# Altium project ESP32-watch.PrjPcb
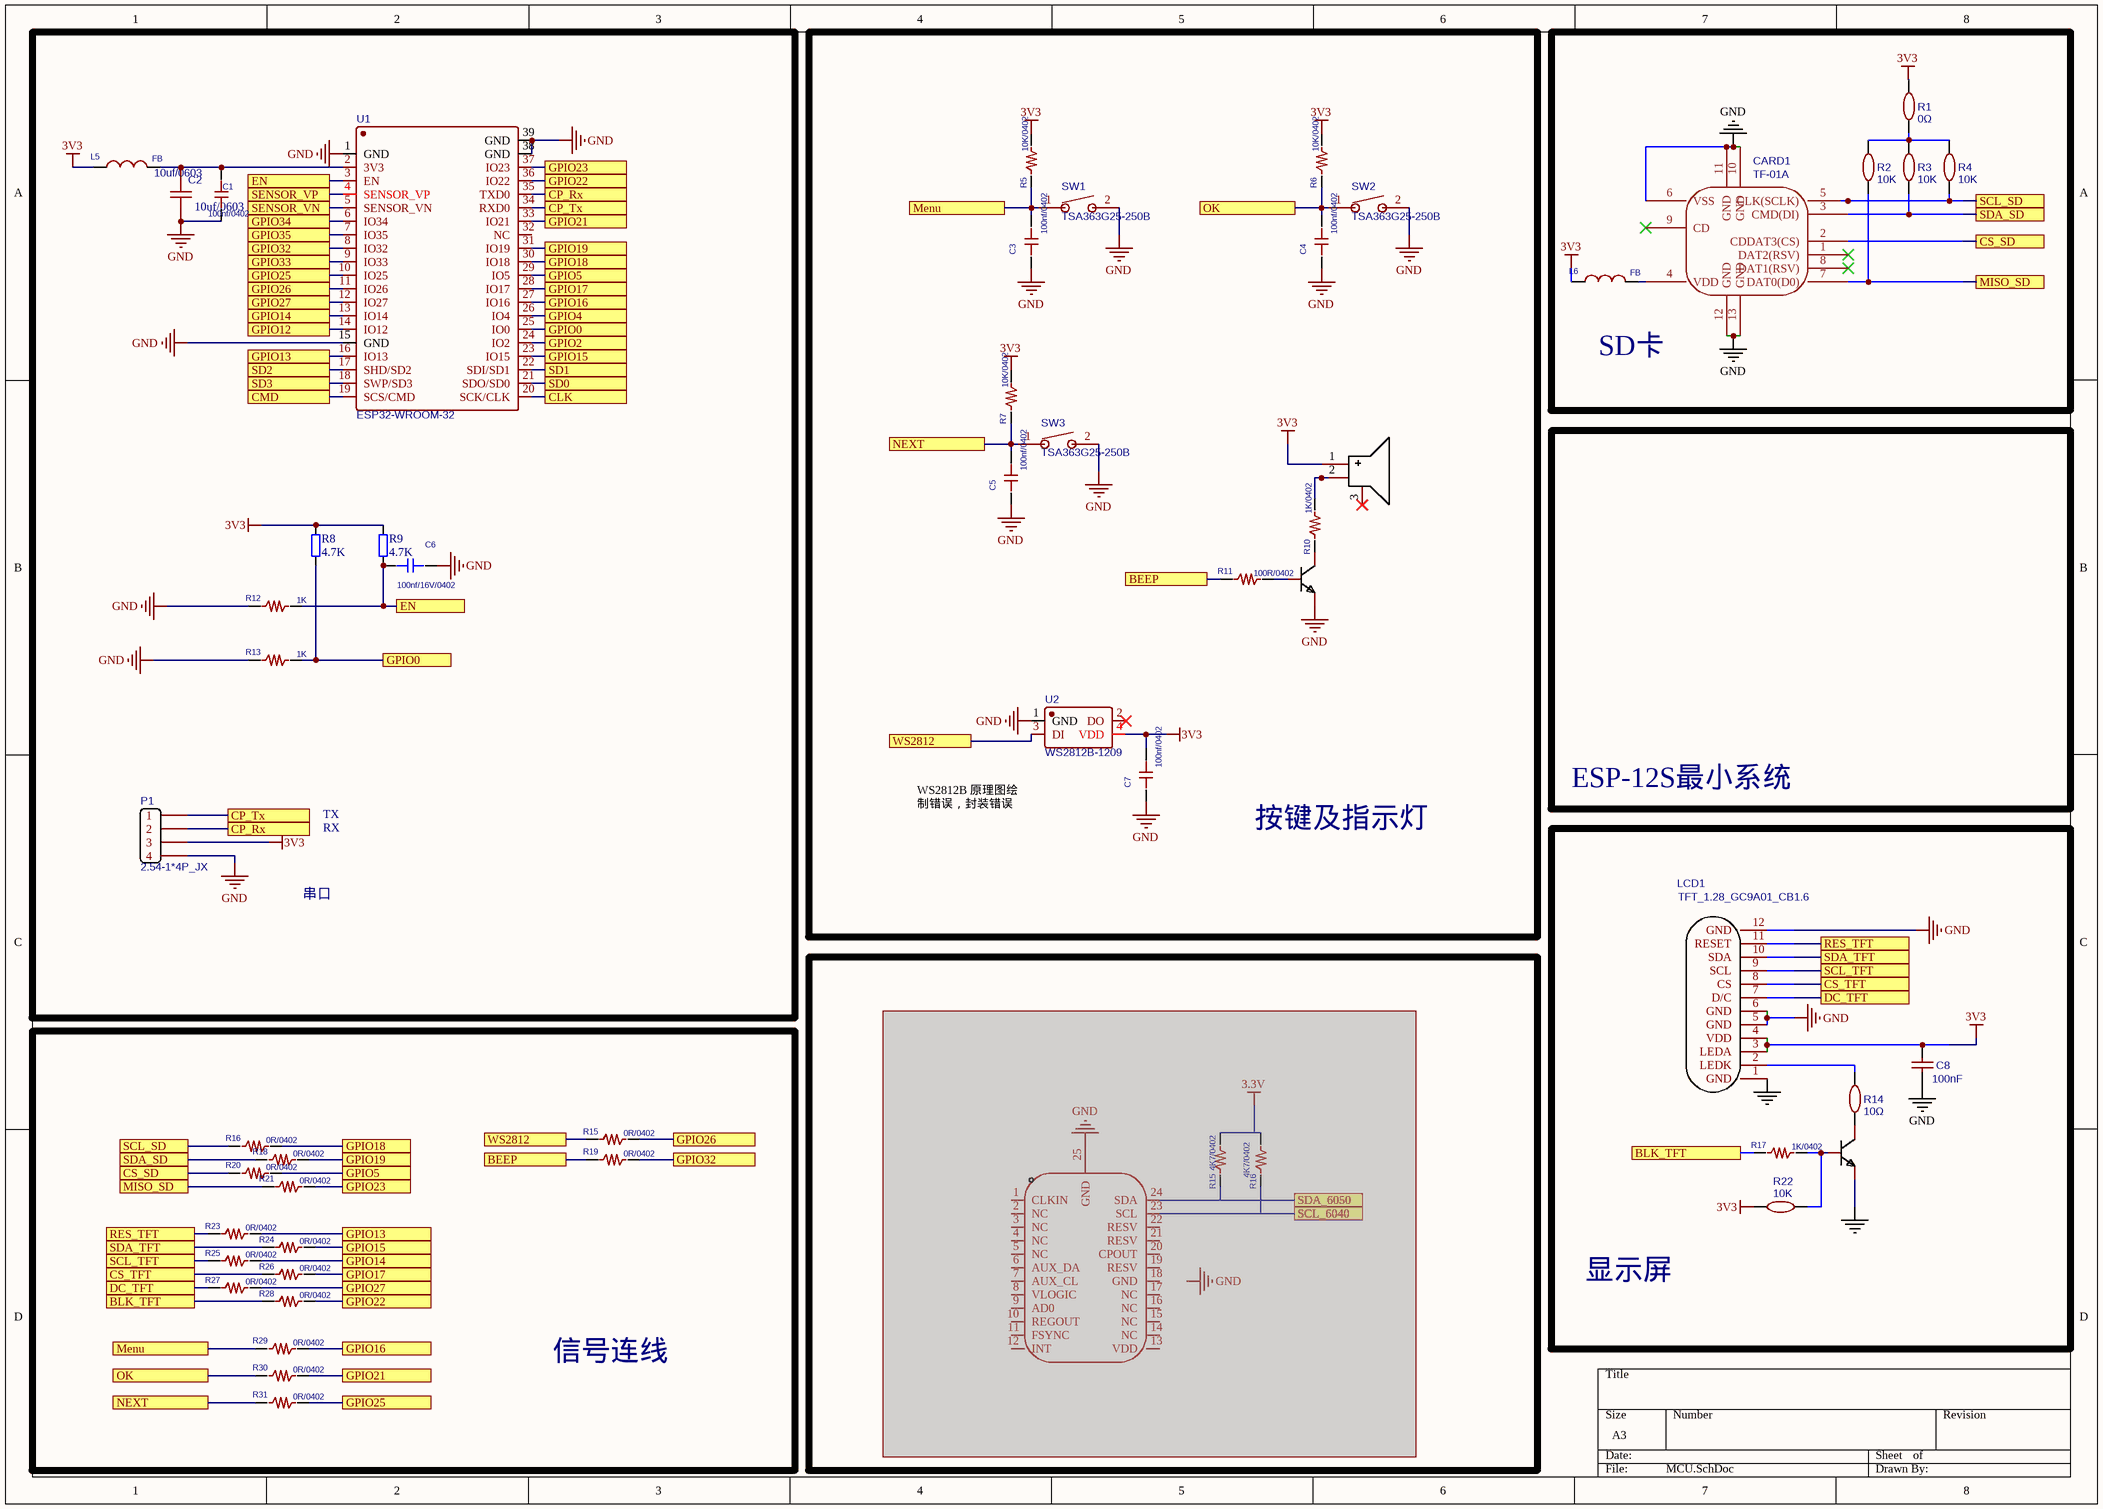
[diagram p0: MCU.SchDoc]
2 sheets, 94 parts. Net scope: global (net labels, ports and power ports of the same name join across sheets).
Board file: watch_esp32.PcbDoc
Sheets:
  MCU.SchDoc
  POWER.SchDoc

## Sheet MCU.SchDoc
size A3

### Parts
(Parts that share a designator on the sheet are numbered #1, #2 ... from top to bottom, then left to right.)
BEEP？1  KLJ-5020  [BUZ-SMD_4P-L5.0-W5.0-P3.80]  (value not drawn)
C1  value 100nf/0402  [C0402]  (hidden comment: 100nf)
C2  10uf/0603  [C0603]
C3  value 100nf/0402  [C0402]  (hidden comment: 100nf)
C4  value 100nf/0402  [C0402]  (hidden comment: 100nf)
C5  value 100nf/0402  [C0402]  (hidden comment: C0402)
C6  value 100nf/16V/0402  [C0402]  (hidden comment: 100nf)
C7  value 100nf/0402  [C0402]  (hidden comment: 100nf)
C8  100nF  [C0402]
CARD1  TF-01A  [TF-SMD_TF-01A]
L5  value FB  [L0603]  (hidden comment: FB0603)
L6  value FB  [R0402]  (hidden comment: FB0402)
LCD1  TFT_1.28_GC9A01_CB1.6  [TFT_1.28_GC9A01_CB0.8_Short]
P1  2.54-1*4P_JX  [CON2X2_SMD_2.54]
Q1  S8050  [SOT-23-3_L2.9-W1.6-P1.90]  (value not drawn)
Q2  S8050  [SOT-23-3_L2.9-W1.6-P1.90]  (value not drawn)
R1  0Ω  [R0603]
R2  10K  [R0402]
R3  10K  [R0402]
R4  10K  [R0402]
R5  value 10K/0402  [R0402]  (hidden comment: 10K)
R6  value 10K/0402  [R0402]  (hidden comment: 10K)
R7  value 10K/0402  [R0402]  (hidden comment: 10K)
R8  4.7K  [R0402]
R9  4.7K  [R0402]
R10  value 1K/0402  [R0402]  (hidden comment: 10K)
R11  value 100R/0402  [R0402]  (hidden comment: 100R)
R12  value 1K  [R0603]  (hidden comment: EN)
R13  value 1K  [R0603]  (hidden comment: GPIO0)
R14  10Ω  [R0402]
R15#1  value 4K7/0402  [R0402]  (hidden comment: R0603)  (masked out: inside a compile mask, not in the netlist)
R15#2  value 0R/0402  [R0402]  (hidden comment: 0R)
R16#1  value 4K7/0402  [R0402]  (hidden comment: R0603)  (masked out: inside a compile mask, not in the netlist)
R16#2  value 0R/0402  [R0402]  (hidden comment: 0R)
R17  value 1K/0402  [R0402]  (hidden comment: 1K)
R18  value 0R/0402  [R0402]  (hidden comment: 0R)
R19  value 0R/0402  [R0402]  (hidden comment: 0R)
R20  value 0R/0402  [R0402]  (hidden comment: 0R)
R21  value 0R/0402  [R0402]  (hidden comment: 0R)
R22  10K  [R0402]
R23  value 0R/0402  [R0402]  (hidden comment: 0R)
R24  value 0R/0402  [R0402]  (hidden comment: 0R)
R25  value 0R/0402  [R0402]  (hidden comment: 0R)
R26  value 0R/0402  [R0402]  (hidden comment: 0R)
R27  value 0R/0402  [R0402]  (hidden comment: 0R)
R28  value 0R/0402  [R0402]  (hidden comment: 0R)
R29  value 0R/0402  [R0402]  (hidden comment: 0R)
R30  value 0R/0402  [R0402]  (hidden comment: 0R)
R31  value 0R/0402  [R0402]  (hidden comment: 0R)
SW1  TSA363G25-250B  [KEY-SMD4_4.5X2.5]
SW2  TSA363G25-250B  [KEY-SMD4_4.5X2.5]
SW3  TSA363G25-250B  [KEY-SMD4_4.5X2.5]
U1  ESP32-WROOM-32  [ESP32-WROOM]
U2#1  WS2812B-1209  [WS2812B]
U2#2  MPU-6050  [QFN-24_L4.0-W4.0-P0.50]  (value not drawn)  (masked out: inside a compile mask, not in the netlist)

### Blocks framed on the sheet
串口: C1 C2 C6 L5 P1 R8 R9 R12 R13 U1
按键及指示灯: BEEP？1 C3-C5 C7 Q1 R5-R7 R10 R11 SW1-SW3 U2#1
SD卡: CARD1 L6 R1-R4
显示屏: C8 LCD1 Q2 R14 R17 R22
信号连线: R15#2 R16#2 R18-R21 R23-R31

### Ports
BEEP, BLK_TFT, CLK, CMD, CP_Rx, CP_Tx, CS_SD, CS_TFT, DC_TFT, EN, GPIO0, GPIO2, GPIO4, GPIO5, GPIO12, GPIO13, GPIO14, GPIO15, GPIO16, GPIO17, GPIO18, GPIO19, GPIO21, GPIO22, GPIO23, GPIO25, GPIO26, GPIO27, GPIO32, GPIO33, GPIO34, GPIO35, Menu, MISO_SD, NEXT, OK, RES_TFT, SCL_6040, SCL_SD, SCL_TFT, SD0, SD1, SD2, SD3, SDA_6050, SDA_SD, SDA_TFT, SENSOR_VN, SENSOR_VP, WS2812

### Nets
3V3: BEEP？1.1(+) C7.2 C8.1 L5.1 L6.1 LCD1.3(LEDA) LCD1.4(VDD) P1.3 R1.1 R5.2 R6.2 R7.2 R8.2 R9.2 R22.1 U2#1.4(VDD)
GND: C1.1 C2.1 C3.1 C4.1 C5.1 C6.1 C7.1 C8.2 CARD1.6(VSS) CARD1.10(GND) CARD1.11(GND) CARD1.12(GND) CARD1.13(GND) LCD1.1(GND) LCD1.5(GND) LCD1.6(GND) LCD1.12(GND) P1.4 Q1.2(E) Q2.2(E) R12.1 R13.1 SW1.2 SW2.2 SW3.2 U1.1(GND) U1.15(GND) U1.38(GND) U1.39(GND) U2#1.1(GND)
NetBEEP？1_2: BEEP？1.2(-) R10.2
NetC1_2: C1.2 C2.2 L5.2 U1.2(3V3)
NetC3_2: C3.2 R5.1 R29.1 SW1.1 ; port Menu
NetC4_2: C4.2 R6.1 R30.1 SW2.1 ; port OK
NetC5_2: C5.2 R7.1 R31.1 SW3.1 ; port NEXT
NetC6_2: C6.2 R9.1 R12.2 U1.3(EN) ; port EN
NetCARD1_2: CARD1.2(CDDAT3(CS)) R20.1 ; port CS_SD
NetCARD1_3: CARD1.3(CMD(DI)) R3.2 R18.1 ; port SDA_SD
NetCARD1_4: CARD1.4(VDD) L6.2
NetCARD1_5: CARD1.5(CLK(SCLK)) R4.2 R16#2.1 ; port SCL_SD
NetCARD1_7: CARD1.7(DAT0(D0)) R2.2 R21.1 ; port MISO_SD
NetLCD1_2: LCD1.2(LEDK) R14.1
NetLCD1_7: LCD1.7(D/C) R27.1 ; port DC_TFT
NetLCD1_8: LCD1.8(CS) R26.1 ; port CS_TFT
NetLCD1_9: LCD1.9(SCL) R25.1 ; port SCL_TFT
NetLCD1_10: LCD1.10(SDA) R24.1 ; port SDA_TFT
NetLCD1_11: LCD1.11(RESET) R23.1 ; port RES_TFT
NetP1_1: P1.1 U1.34(RXD0) ; port CP_Tx
NetP1_2: P1.2 U1.35(TXD0) ; port CP_Rx
NetQ1_1: Q1.1(B) R11.2
NetQ1_3: Q1.3(C) R10.1
NetQ2_1: Q2.1(B) R17.2 R22.2
NetQ2_3: Q2.3(C) R14.2
NetR1_2: R1.2 R2.1 R3.1 R4.1
NetR8_1: R8.1 R13.2 U1.25(IO0) ; port GPIO0
NetR11_1: R11.1 R19.1 ; port BEEP
NetR15#2_1: R15#2.1 U2#1.3(DI) ; port WS2812
NetR15#2_2: R15#2.2 U1.11(IO26) ; port GPIO26
NetR16#2_2: R16#2.2 U1.30(IO18) ; port GPIO18
NetR17_1: R17.1 R28.1 ; port BLK_TFT
NetR18_2: R18.2 U1.31(IO19) ; port GPIO19
NetR19_2: R19.2 U1.8(IO32) ; port GPIO32
NetR20_2: R20.2 U1.29(IO5) ; port GPIO5
NetR21_2: R21.2 U1.37(IO23) ; port GPIO23
NetR23_2: R23.2 U1.16(IO13) ; port GPIO13
NetR24_2: R24.2 U1.23(IO15) ; port GPIO15
NetR25_2: R25.2 U1.13(IO14) ; port GPIO14
NetR26_2: R26.2 U1.28(IO17) ; port GPIO17
NetR27_2: R27.2 U1.12(IO27) ; port GPIO27
NetR28_2: R28.2 U1.36(IO22) ; port GPIO22
NetR29_2: R29.2 U1.27(IO16) ; port GPIO16
NetR30_2: R30.2 U1.33(IO21) ; port GPIO21
NetR31_2: R31.2 U1.10(IO25) ; port GPIO25
NetU1_4: U1.4(SENSOR_VP) ; port SENSOR_VP
NetU1_5: U1.5(SENSOR_VN) ; port SENSOR_VN
NetU1_6: U1.6(IO34) ; port GPIO34
NetU1_7: U1.7(IO35) ; port GPIO35
NetU1_9: U1.9(IO33) ; port GPIO33
NetU1_14: U1.14(IO12) ; port GPIO12
NetU1_17: U1.17(SHD/SD2) ; port SD2
NetU1_18: U1.18(SWP/SD3) ; port SD3
NetU1_19: U1.19(SCS/CMD) ; port CMD
NetU1_20: U1.20(SCK/CLK) ; port CLK
NetU1_21: U1.21(SDO/SD0) ; port SD0
NetU1_22: U1.22(SDI/SD1) ; port SD1
NetU1_24: U1.24(IO2) ; port GPIO2
NetU1_26: U1.26(IO4) ; port GPIO4

Not connected (* = marked no-connect by the designer): BEEP？1 3(NC)*; CARD1 1(DAT2(RSV))* 8(DAT1(RSV))* 9(CD)*; U1 32(NC); U2#1 2(DO)*

### Notes on the sheet
- RX
- TX
- (near U2#1) WS2812B 原理图绘制错误，封装错误
- ESP-12S最小系统

### Library data of the parts
BEEP？1 = BEEP_3P_5020: Manufacturer: KELIKING(凯丽金); Add into BOM: yes; Name: KLJ-5020; Symbol: KLJ-5020; Device: KLJ-5020; LCSC Part Name: 贴片蜂鸣器; Supplier Part: C556937; Manufacturer Part: KLJ-5020; Supplier Footprint: SMD; JLCPCB Part Class: Extended Part; Datasheet: https://atta.szlcsc.com/upload/public/pdf/source/20200519/C556937_434224E60D77FB2EA05BB02010B3CD4E.pdf; Supplier: LCSC; Convert to PCB: yes
C1 C3-C7 = C0402: PCB DECAL: CAP_0603_FIRE
C2 = C0603: BOM_Manufacturer: Samsung Electro-Mechanics; BOM_Manufacturer Part: 10uF; nameAlias: Value; Contributor: LCSC; BOM_Supplier: LCSC; BOM_Supplier Part: C15415; spicePre: C; spiceSymbolName: 10UF
C8 = 100nF: BOM_Manufacturer: YAGEO; BOM_Manufacturer Part: CC0402KRX5R9BB104; nameAlias: Capacitance; BOM_Supplier: LCSC; BOM_Supplier Part: C105882; BOM_JLCPCB Part Class: Extended Part; spicePre: C; spiceSymbolName: CC0402KRX5R9BB104
CARD1 = TF-01A: BOM_Manufacturer: HRO; BOM_Supplier: LCSC; BOM_Manufacturer Part: TF-01A; BOM_Supplier Part: C91145; BOM_JLCPCB Part Class: Extended Part; spicePre: C; spiceSymbolName: TF-01A
L5 = FB0603: 0603; Manufacturer #1 PN: BEAD; PCB DECAL: L0603
L6 = FB0402: 0402; Manufacturer #1 PN: BEAD; PCB DECAL: L0603
LCD1 = TFT_1.28_GC9A01_CB1.6: Contributor: 启凡科创; spicePre: L; spiceSymbolName: TFT_1.28_GC9A01_CB1.6
P1 = CON1X4_2.54: BOM_Supplier Part: C115245; BOM_Supplier: LCSC; spicePre: P; spiceSymbolName: 2.54-1*4P_JX
Q1 Q2 = NPN: Manufacturer: PUOLOP(迪浦); Symbol: S8050_C2894711; Add into BOM: yes; Name: S8050; Device: S8050; LCSC Part Name: S8050; Supplier Part: C2894711; Manufacturer Part: S8050; Supplier Footprint: SOT-23; JLCPCB Part Class: Extended Part; Datasheet: https://atta.szlcsc.com/upload/public/pdf/source/20210914/8A9A4EB0A2D7D299FDA7647183468EB4.pdf; Supplier: LCSC; Convert to PCB: yes
R1 = 0Ω: BOM_Manufacturer: UniOhm; BOM_Manufacturer Part: 0603WAJ0000T5E; nameAlias: Resistance; Resistance (Ohms): 0; BOM_Supplier: LCSC; BOM_Supplier Part: C15402; BOM_JLCPCB Part Class: Extended Part; spicePre: R; spiceSymbolName: 0603WAJ0000T5E
R2-R4 R22 = 10K: BOM_Manufacturer: UniOhm; BOM_Manufacturer Part: 0402WGF1002TCE; nameAlias: Resistance (Ohms); BOM_Supplier: LCSC; BOM_Supplier Part: C25744; BOM_JLCPCB Part Class: Basic Part; spicePre: R; spiceSymbolName: 0402WGF1002TCE
R5-R7 R10 R11 R15#1 R15#2 R16#1 R16#2 R17-R21 R23-R31 = R0402: PCB DECAL: R_0603
R8 R9 = R0402
R12 R13 = R0603: PCB DECAL: R_0603
R14 = 10Ω: BOM_Manufacturer: UniOhm; BOM_Manufacturer Part: 0402WGF100JTCE; nameAlias: Resistance; Resistance (Ohms): 10; BOM_Supplier: LCSC; BOM_Supplier Part: C25077; BOM_JLCPCB Part Class: Basic Part; spicePre: R; spiceSymbolName: 0402WGF100JTCE
SW1-SW3 = SMD SW3*6: BOM_Manufacturer: BRIGHT; Contributor: LCSC; BOM_Supplier: LCSC; BOM_Supplier Part: C354943; BOM_Manufacturer Part: TSA363G25-250B; BOM_JLCPCB Part Class: Extended Part; spicePre: S; spiceSymbolName: TSA363G25-250B
U1 = ESP32-WROOM-32: BOM_Manufacturer: Espressif Systems; Contributor: LCSC; BOM_Supplier: LCSC; BOM_Supplier Part: C82899; BOM_Manufacturer Part: ESP32-WROOM-32; BOM_JLCPCB Part Class: Extended Part; spicePre: U; spiceSymbolName: ESP32-WROOM-32
U2#1 = WS2812B-1209: BOM_Manufacturer: null; Contributor: LCSC; BOM_Supplier: LCSC; BOM_Supplier Part: C2835111; BOM_Manufacturer Part: WS2812B-1209; BOM_JLCPCB Part Class: Extended Part; spicePre: U; spiceSymbolName: WS2812B-1209
U2#2 = MPU-6050: Manufacturer: TDK InvenSense(应美盛); Symbol: MPU-6050_C24112; Add into BOM: yes; Name: MPU-6050; Device: MPU-6050; LCSC Part Name: MPU-6050; Supplier Part: C24112; Manufacturer Part: MPU-6050; Supplier Footprint: QFN-24_4x4x05P; JLCPCB Part Class: Extended Part; Datasheet: https://atta.szlcsc.com/upload/public/pdf/source/20140425/1457707046159.pdf; Supplier: LCSC; Convert to PCB: yes

## Sheet POWER.SchDoc
size A3
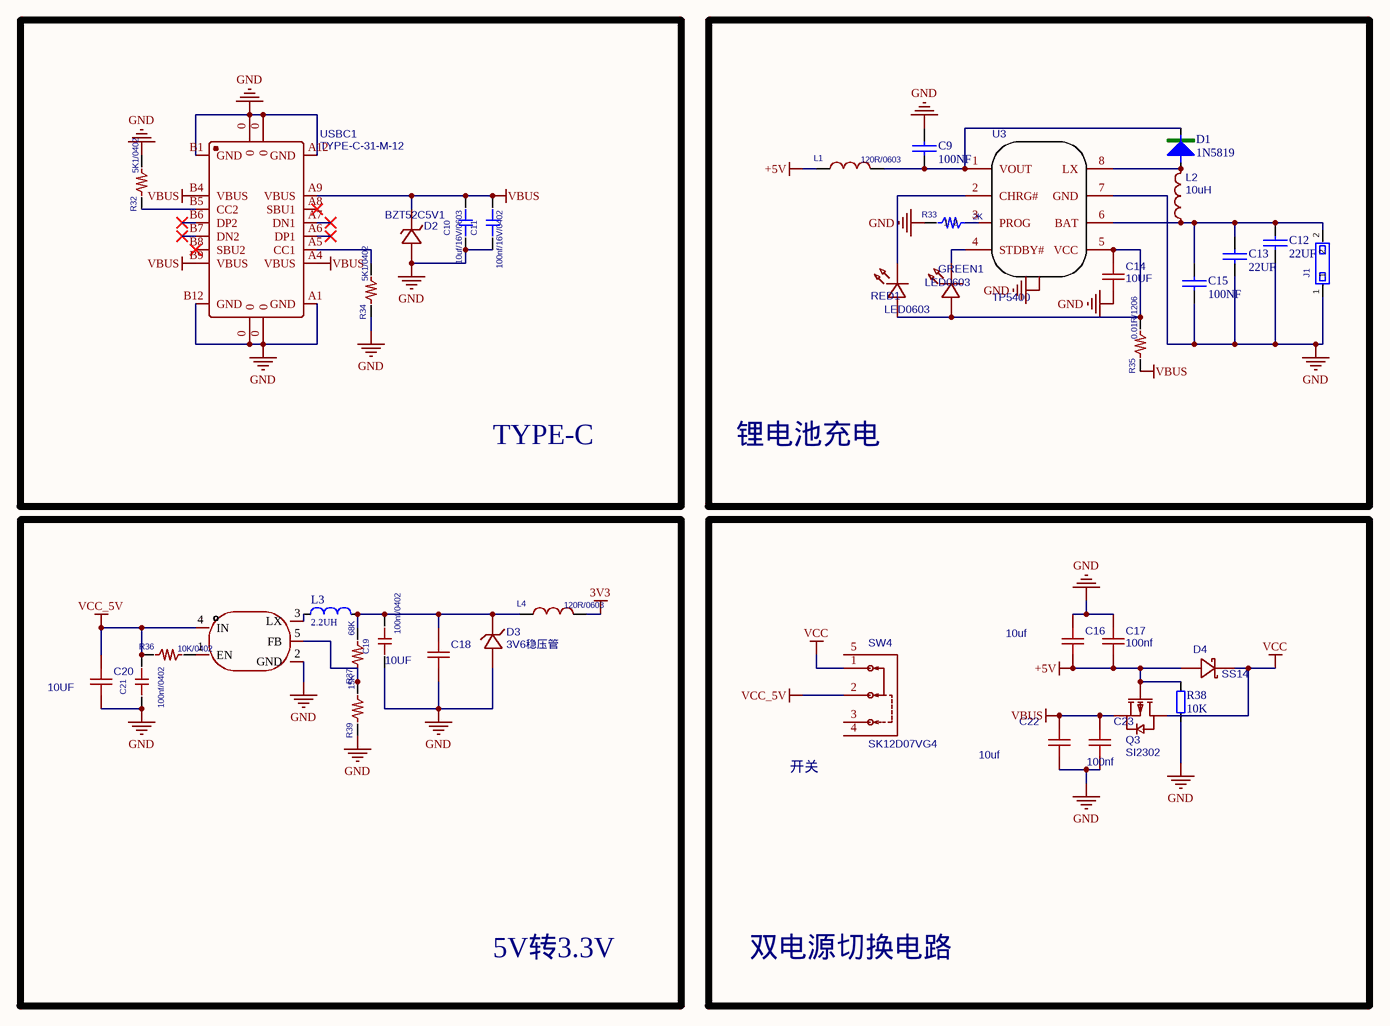
[diagram p1: POWER.SchDoc]

### Parts
C9  100NF  [C0402]
C10  value 10uf/16V/0603  [C0402]  (hidden comment: 100nf)
C11  value 100nf/16V/0402  [C0402]  (hidden comment: 100nf)
C12  22UF  [C0603]
C13  22UF  [C0603]
C14  10UF  [C0402]
C15  100NF  [C0402]
C16  10uf  [C0603]
C17  100nf  [C0402]
C18  10UF  [C0603]
C19  value 100nf/0402  [C0402]  (hidden comment: 100nf)
C20  10UF  [C0603]
C21  value 100nf/0402  [C0402]  (hidden comment: 100nf)
C22  10uf  [C0603]
C23  100nf  [C0402]
D1  1N5819  [SOD-123_L2.7-W1.6]
D2  BZT52C5V1  [SOD-123_L2.7-W1.6]
D3  3V6稳压管  [SOD-123_L2.7-W1.6]
D4  SS14  [SOD-123_L2.7-W1.6]
GREEN1  LED0603  [LED0603]
J1  1X2PIN_SMD  [SMD1X2_2.54]  (value not drawn)
L1  value 120R/0603  [L0603]  (hidden comment: 120R)
L2  10uH  [L_SMD_L4.0-W4.0]
L3  2.2UH  [L_SMD_L4.0-W4.0]
L4  value 120R/0603  [L0603]  (hidden comment: 120R)
Q3  SI2302  [SOT-23-3_L2.9-W1.6-P1.90]
R32  value 5K1/0402  [R0402]  (hidden comment: 5K1)
R33  2K  [R0603]
R34  value 5K1/0402  [R0402]  (hidden comment: 5K1)
R35  value 0.01R/1206  [R1206]  (hidden comment: 0.01R)
R36  value 10K/0402  [R0402]  (hidden comment: R0603)
R37  68K  [R0402]
R38  10K  [R0402]
R39  15K  [R0402]
RED1  LED0603  [LED0603]
SW4  SK12D07VG4  [SW-TH_5P]
U3  TP5400  [SOIC-8_L5.0-W4.0-P1.27-LS6.0_EP2.0]
U4  SY8088AAC  [SOT23-5]  (value not drawn)
USBC1  TYPE-C-31-M-12  [TYPEC_F_16_SMD_U]

### Blocks framed on the sheet
TYPE-C: C10 C11 D2 R32 R34 USBC1
锂电池充电: C9 C12-C15 D1 GREEN1 J1 L1 L2 R33 R35 RED1 U3
5V转3.3V: C18-C21 D3 L3 L4 R36 R37 R39 U4
双电源切换电路: C16 C17 C22 C23 D4 Q3 R38 SW4

### Nets
3V3: L4.2
+5V: C16.2 C17.2 D4.2 L1.1 Q3.1(G) R38.2
GND: C9.1 C10.1 C11.1 C12.2 C13.2 C14.1 C15.2 C16.1 C17.1 C18.1 C19.1 C20.1 C21.1 C22.1 C23.1 D2.2(A) D3.2 J1.1 R32.2 R33.1 R34.1 R38.1 R39.1 U3.7(GND) U3.9 U4.2(GND) USBC1.0 USBC1.A1(GND) USBC1.A12(GND) USBC1.B1(GND) USBC1.B12(GND)
VBUS: C10.2 C11.2 C22.2 C23.2 D2.1(K) Q3.2(S) R35.1 USBC1.A4(VBUS) USBC1.A9(VBUS) USBC1.B4(VBUS) USBC1.B9(VBUS)
VCC: D4.1 Q3.3(D) SW4.1
VCC_5V: C20.2 C21.2 R36.1 SW4.2 U4.4(IN)
NetC9_2: C9.2 D1.2 L1.2 U3.1(VOUT)
NetC12_1: C12.1 C13.1 C15.1 J1.2 L2.1 U3.6(BAT)
NetC14_2: C14.2 GREEN1.1 R35.2 RED1.1 U3.5(VCC)
NetC18_2: C18.2 C19.2 D3.1 L3.2 L4.1 R37.2
NetD1_1: D1.1 L2.2 U3.8(LX)
NetGREEN1_2: GREEN1.2 U3.4(STDBY#)
NetL3_1: L3.1 U4.3(LX)
NetR32_1: R32.1 USBC1.B5(CC2)
NetR33_2: R33.2 U3.3(PROG)
NetR34_2: R34.2 USBC1.A5(CC1)
NetR36_2: R36.2 U4.1(EN)
NetR37_1: R37.1 R39.2 U4.5(FB)
NetRED1_2: RED1.2 U3.2(CHRG#)

Not connected (* = marked no-connect by the designer): SW4 3 4 5; USBC1 A6(DP1)* A7(DN1)* A8(SBU1)* B6(DP2)* B7(DN2)* B8(SBU2)*

### Notes on the sheet
- 开关

### Library data of the parts
C9 C12 C13 C15 = C0805: Capacitor
C10 C11 C19 C21 = C0402: PCB DECAL: CAP_0603_FIRE
C14 C18 C20 = C0603: BOM_Manufacturer: Samsung Electro-Mechanics; nameAlias: Value; Contributor: LCSC; BOM_Supplier: LCSC; BOM_Supplier Part: C15415; BOM_Manufacturer Part: 10uF; spicePre: C; spiceSymbolName: 10UF
C16 C17 C22 C23 = 10uf: BOM_Manufacturer: Samsung Electro-Mechanics; nameAlias: Value; Contributor: LCSC; BOM_Supplier: LCSC; BOM_Supplier Part: C15415; BOM_Manufacturer Part: 10uF; spicePre: C; spiceSymbolName: 10UF
D1 = 1N5819: 肖特基二极管
D2 = BZT52C5V1_C1884555: BOM_Manufacturer: YFW佑风微; Contributor: LCSC; BOM_Supplier: LCSC; BOM_Supplier Part: C1884555; BOM_Manufacturer Part: BZT52C5V1; BOM_JLCPCB Part Class: Extended Part; spicePre: D; spiceSymbolName: BZT52C5V1_C1884555
D3 = D_STB: 稳压管; BOM_Manufacturer: SK; BOM_Manufacturer Part: BZT52C3V3; Contributor: LCSC; BOM_Supplier: LCSC; BOM_Supplier Part: C216707; BOM_JLCPCB Part Class: Extended Part; spicePre: D; spiceSymbolName: BZT52C3V3_C216707
D4 = SS34_C2909963: BOM_Manufacturer: YONGYUTAI(永裕泰); BOM_Manufacturer Part: SS34; Contributor: LCSC; BOM_Supplier: LCSC; BOM_Supplier Part: C2909963; BOM_JLCPCB Part Class: Extended Part; spicePre: D; spiceSymbolName: SS34_C2909963
GREEN1 RED1 = LED0603: BOM_Manufacturer: EVERLIGHT(台湾亿光); BOM_Manufacturer Part: 19-217/R6C-AL1M2VY/3T; Contributor: LCEDA_01; BOM_Supplier Part: C72044; BOM_Supplier: LCSC; spicePre: L; spiceSymbolName: LED-0603_R
L1 L4 = FB0603: 0603; Manufacturer #1 PN: BEAD; PCB DECAL: L0603
L2 = 10uH: BOM_Manufacturer: Sunlord; BOM_Manufacturer Part: SWPA4030S100MT; nameAlias: Inductance; BOM_Supplier: LCSC; BOM_Supplier Part: C38117; BOM_JLCPCB Part Class: Extended Part; spicePre: L; spiceSymbolName: SWPA4030S100MT
L3 = INDUCTOR: 电感
Q3 = FDN338P_C518789: P场效应管; BOM_Manufacturer: HUASHUO; Contributor: LCSC; BOM_Supplier: LCSC; BOM_Supplier Part: C518789; BOM_Manufacturer Part: FDN338P; BOM_JLCPCB Part Class: Extended Part; spicePre: Q; spiceSymbolName: FDN338P_C518789
R32 R34 R36 R37 R39 = R0402: PCB DECAL: R_0603
  R37: Value: 68K
  R39: Value: 15K
R33 = R0603: PCB DECAL: R_0603; Value: 2K
R35 = R1206: PCB DECAL: R_0603
R38 = R0402
SW4 = SW-bodong: 拨动开关; BOM_Manufacturer: SHOU HAN; Contributor: LCSC; BOM_Supplier: LCSC; BOM_Supplier Part: C393937; BOM_Manufacturer Part: SK12D07VG4; BOM_JLCPCB Part Class: Extended Part; spicePre: S; spiceSymbolName: SK12D07VG4
U3 = TP5400: 锂电池充放电; BOM_Manufacturer: TOPPOWER; BOM_Supplier: LCSC; BOM_Manufacturer Part: TP5400; BOM_Supplier Part: C24154; BOM_JLCPCB Part Class: Extended Part; spicePre: U; spiceSymbolName: TP5400
U4 = SY8088AAC: Manufacturer: 矽力杰silergy; Add into BOM: yes; Function: 降压型; Name: SY8088AAC; Symbol: SY8088AAC; Device: SY8088AAC; LCSC Part Name: 降压型; Supplier Part: C79313; Manufacturer Part: SY8088AAC; Supplier Footprint: SOT-23-5; JLCPCB Part Class: Extended Part; Datasheet: https://atta.szlcsc.com/upload/public/pdf/source/20170329/1490752163260.pdf; Supplier: LCSC; Convert to PCB: yes; Synchronous Rectification: -; Number of Outputs: -; Topology: -; Input Voltage: -; Output Current (Max): -; Switching Frequency: -
USBC1 = TYPE-C-31-M-12: BOM_Manufacturer: Rectangular Connectors - Contacts; Contributor: LCSC; BOM_Supplier: LCSC; BOM_Supplier Part: C165948; BOM_Manufacturer Part: TYPE-C-31-M-12; spicePre: U; spiceSymbolName: TYPE-C-31-M-12
J1 = 1X2PIN_SMD: PCB DECAL: 1X2PIN_SMD

## Nets that join several sheets
3V3: MCU (16 pins), POWER (L4.2)
GND: MCU (30 pins), POWER (31 pins)